# EAGLE design dsky_md_2.1v (EAGLE 6.5.0)
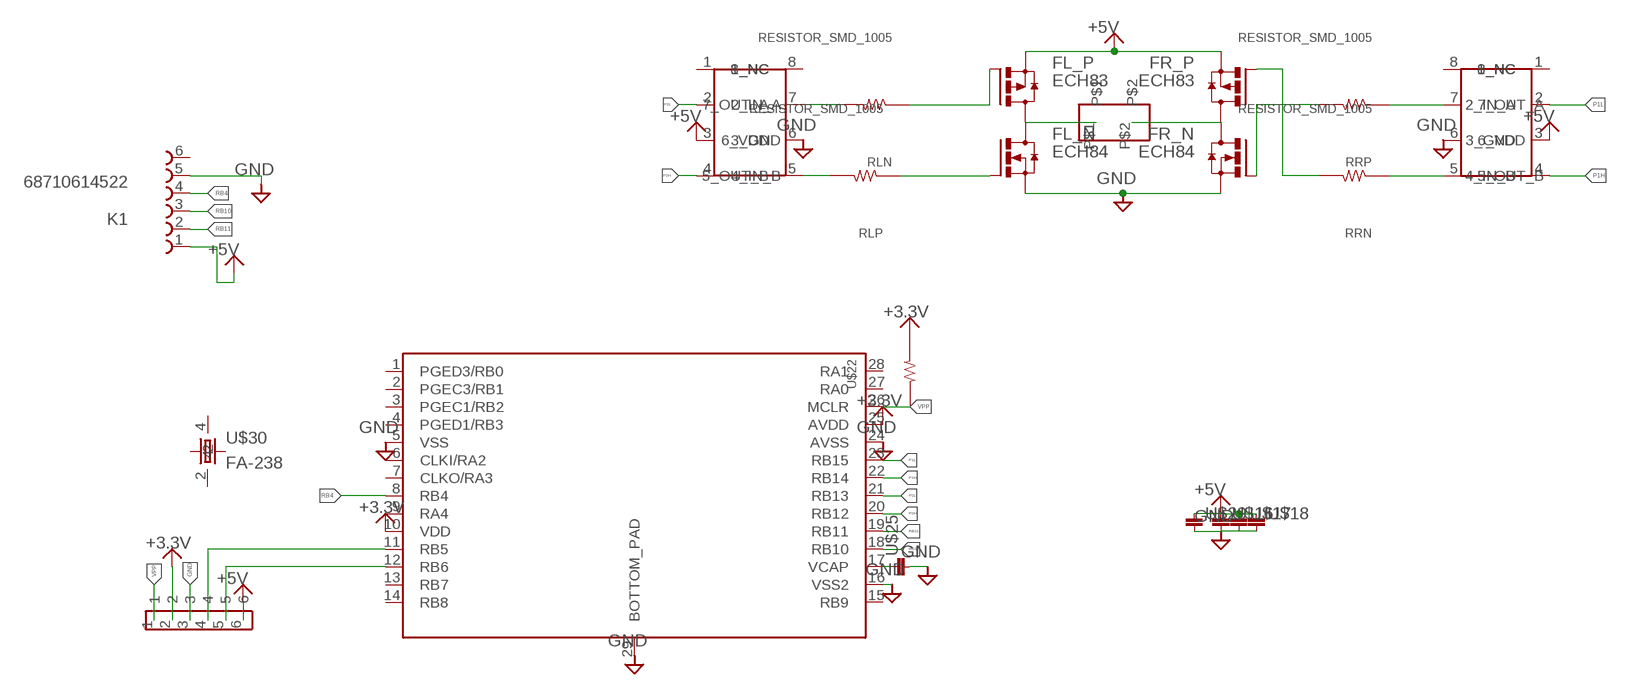
[diagram p0: schematic, sheet 1]

## Parts
FL_N  ECH84  [ECH8]
FL_P  ECH83  [ECH8]
FR_N  ECH84  [ECH8]
FR_P  ECH83  [ECH8]
IC_L  TC1427COA  [SOIC8]
IC_R  TC1427COA  [SOIC8]
K1  68710614522  [68710614522]
RLN  RESISTOR_SMD_1005  [1005]
RLP  RESISTOR_SMD_1005  [1005]
RRN  RESISTOR_SMD_1005  [1005]
RRP  RESISTOR_SMD_1005  [1005]
U$3  PIN_HEADER_2  [PIN_HEADER_2S]
U$5  DSPIC33EP32MC202  [QFN-S28_6X6MC]
U$6  PIN_HEADER_HALF_6  [PIN_HEADER_HALF_6]
U$16  1608  [1608]
U$17  1608  [1608]
U$18  1608  [1608]
U$22  RESISTOR__SMD  [1608]
U$25  1608  [1608]
U$29  2012  [2012]
U$30  FA-238  [FA-238]

## Nets
+3.3V: U$5.10(VDD) U$5.25(AVDD) U$6.2 U$22.2
+5V: FL_P.1(S) FL_P.2(S) FL_P.3(S) FR_P.1(S) FR_P.2(S) FR_P.3(S) IC_L.3(3_GND) IC_R.3(3_GND) K1.1 U$6.6 U$16.P$1 U$17.P$1 U$18.P$1 U$29.1
GND: FL_N.1(S) FL_N.2(S) FL_N.3(S) FR_N.1(S) FR_N.2(S) FR_N.3(S) IC_L.6(6_VDD) IC_R.6(6_VDD) K1.5 U$5.5(VSS) U$5.16(VSS2) U$5.24(AVSS) U$5.29(BOTTOM_PAD) U$6.3 U$16.P$2 U$17.P$2 U$18.P$2 U$25.P$2 U$29.2
M_L: FL_N.5(D) FL_N.6(D) FL_N.7(D) FL_N.8(D) FL_P.5(D) FL_P.6(D) FL_P.7(D) FL_P.8(D) U$3.P$1
M_R: FR_N.5(D) FR_N.6(D) FR_N.7(D) FR_N.8(D) FR_P.5(D) FR_P.6(D) FR_P.7(D) FR_P.8(D) U$3.P$2
N$1: FL_P.4(G) RLN.1
N$2: FL_N.4(G) RLP.1
N$3: IC_L.7(7_OUT_A) RLN.2
N$4: FR_P.4(G) RRN.2
N$5: IC_L.5(5_OUT_B) RLP.2
N$6: IC_R.7(7_OUT_A) RRP.1
N$7: U$5.17(VCAP) U$25.P$1
N$9: IC_R.5(5_OUT_B) RRN.1
N$10: U$5.11(RB5) U$6.4
N$11: U$5.12(RB6) U$6.5
N$12: FR_N.4(G) RRP.2
P1H: IC_R.4(4_IN_B) U$5.22(RB14)
P1L: IC_R.2(2_IN_A) U$5.23(RB15)
P2H: IC_L.4(4_IN_B) U$5.20(RB12)
P2L: IC_L.2(2_IN_A) U$5.21(RB13)
RB4: K1.4 U$5.8(RB4)
RB10: K1.3 U$5.18(RB10)
RB11: K1.2 U$5.19(RB11)
VPP: U$5.26(MCLR) U$6.1 U$22.1
Unconnected: IC_L.1(1_NC) IC_L.8(8_NC) IC_R.1(1_NC) IC_R.8(8_NC) K1.6 U$5.1(PGED3/RB0) U$5.2(PGEC3/RB1) U$5.3(PGEC1/RB2) U$5.4(PGED1/RB3) U$5.6(CLKI/RA2) U$5.7(CLKO/RA3) U$5.9(RA4) U$5.13(RB7) U$5.14(RB8) U$5.15(RB9) U$5.27(RA0) U$5.28(RA1) U$30.1 U$30.2 U$30.3 U$30.4

## Library data of the parts
FL_N FR_N = 06_FET:ECH84
FL_P FR_P = 06_FET:ECH83
IC_L IC_R = 04_IC:TC1427COA
K1 = Wuerth_Elektronik_eiCan_03_ZIF_Connectors_Flat_Flexible_Cable:68710614522: WE-FPC 0.5mm SMT ZIF Horizontal Bottom Contact, 6 Pins
RLN RLP RRN RRP = 01_R:RESISTOR_SMD_1005
U$3 = 08_CONECTOR:PIN_HEADER_2
U$5 = microchip-dspic:DSPIC33EP32MC202
U$6 = 08_CONECTOR:PIN_HEADER_HALF_6
U$16-U$18 U$25 = 02_C:1608
U$22 = 01_R:RESISTOR__SMD
U$29 = 02_C:2012
U$30 = 09_2_CRYSTAL:FA-238

## Board
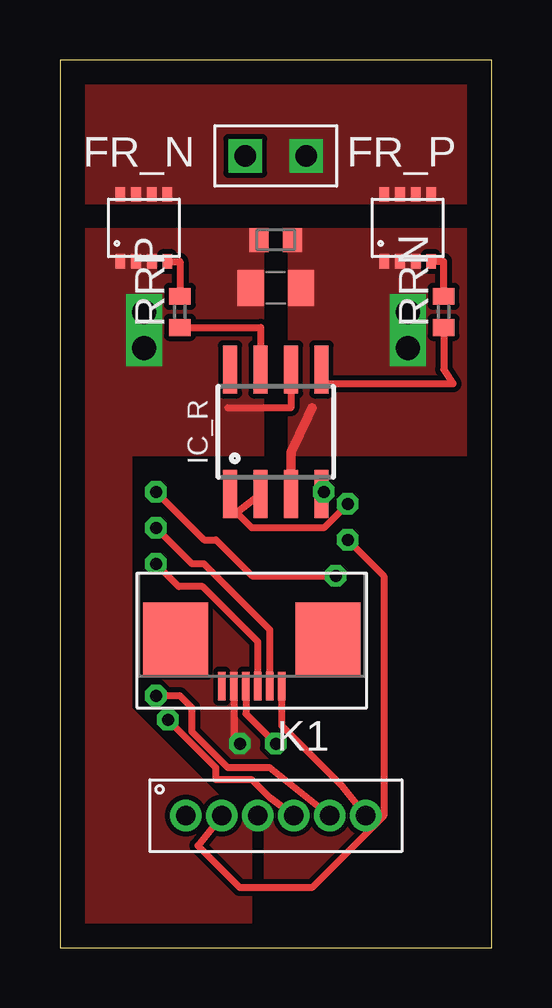
[diagram p1: board, top side]
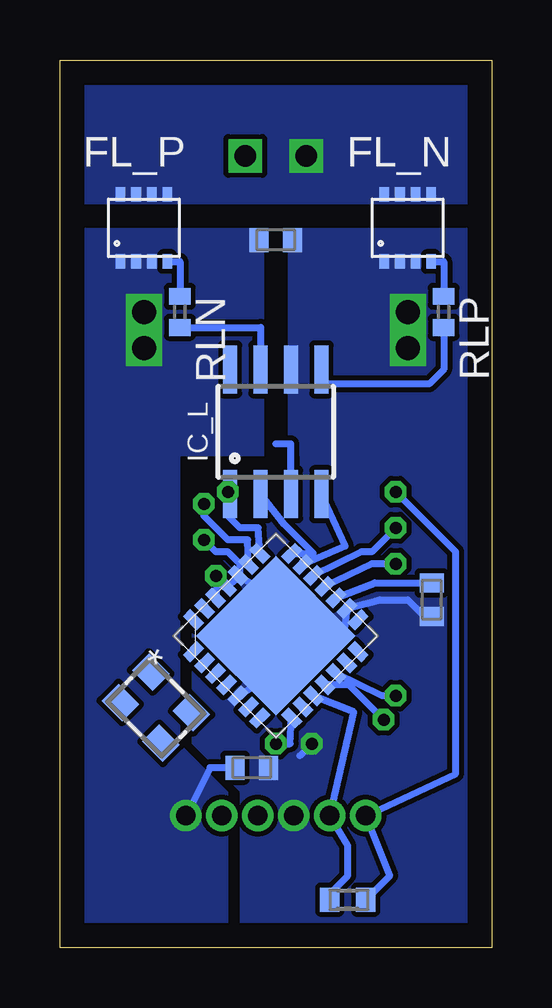
[diagram p2: board, bottom side, seen from below]

Size 18 x 37 mm. Coordinates in mm from the lower left corner, seen from the top.
Outline: 0,0 18,0 18,37 0,37 0,0
Copper layers (1*16): Top 0.035mm / dielectric 1.5mm / Bottom 0.035mm
Design rules "default": minimum track width 10mil, minimum drill 24mil, track to track 8mil, track to pad 8mil, pad to pad 8mil, via to via 8mil, smd to smd 8mil, copper to edge 40mil, drill to drill 8mil, minimum pad ring 10mil, minimum via ring 8mil, stop-mask expansion 4mil, vias tented up to drill 0mil, thermal gap 10mil

### Footprints (pad centres in the part's own frame; a part is rotated, then mirrored left to right if it is on the bottom)
ECH8 = smd 0.4 x 0.6: 1 -0.975,-1.4; 2 -0.325,-1.4; 3 0.325,-1.4; 4 0.975,-1.4; 5 0.975,1.4; 6 0.325,1.4; 7 -0.325,1.4; 8 -0.975,1.4
SOIC8 = smd 0.6 x 2: 1 -1.905,-2.6; 2 -0.635,-2.6; 3 0.635,-2.6; 4 1.905,-2.6; 5 1.905,2.6; 6 0.635,2.6; 7 -0.635,2.6; 8 -1.905,2.6
68710614522 = smd 0.3 x 1.2: 1 -1.25,0.6; 2 -0.75,0.6; 3 -0.25,0.6; 4 0.25,0.6; 5 0.75,0.6; 6 1.25,0.6 | smd 2.7 x 3: Z1 -3.18,-1.38; Z2 3.18,-1.38
1005 = smd 0.7 x 0.9: 1 -0.65,0; 2 0.65,0
PIN_HEADER_2S = drill 0.9 square: P$1 -1.27,0; P$2 1.27,0
QFN-S28_6X6MC = smd 0.813 x 0.432: 1 -2.896,1.956; 2 -2.896,1.295; 3 -2.896,0.66; 4 -2.896,0; 5 -2.896,-0.66; 6 -2.896,-1.295; 7 -2.896,-1.956; 15 2.896,-1.956; 16 2.896,-1.295; 17 2.896,-0.66; 18 2.896,0; 19 2.896,0.66; 20 2.896,1.295; 21 2.896,1.956 | smd 0.432 x 0.813: 8 -1.956,-2.896; 9 -1.295,-2.896; 10 -0.66,-2.896; 11 0,-2.896; 12 0.66,-2.896; 13 1.295,-2.896; 14 1.956,-2.896; 22 1.956,2.896; 23 1.295,2.896; 24 0.66,2.896; 25 0,2.896; 26 -0.66,2.896; 27 -1.295,2.896; 28 -1.956,2.896 | smd 4.699 x 4.699: 29 0,0
PIN_HEADER_HALF_6 = drill 0.8 pad 1.2: 1 -3,0; 2 -1.5,0; 3 0,0; 4 1.5,0; 5 3,0; 6 4.5,0
1608 = smd 0.8 x 1: P$1 -0.7,0; P$2 0.7,0
1608' = smd 0.8 x 1: 1 -0.75,0; 2 0.75,0
2012 = smd 1.1 x 1.5: 1 -1.05,0; 2 1.05,0
FA-238 = smd 1.2 x 1: 1 -1.2,-0.9; 2 1.2,-0.9; 3 1.2,0.9; 4 -1.2,0.9

### Placement (x,y rotation side)
FL_N  3.5,30 0 bottom
FL_P  14.5,30 0 bottom
FR_N  3.5,30 0 top
FR_P  14.5,30 0 top
IC_L  9,21.5 0 bottom
IC_R  9,21.5 0 top
K1  8,11.5 180 top
RLN  13,26.5 270 bottom
RLP  2,26.5 270 bottom
RRN  16,26.5 90 top
RRP  5,26.5 90 top
U$3  9,33 0 top
U$5  9,13 45 bottom
U$6  8.25,5.5 0 top
U$16  9,29.5 180 top
U$17  9,29.5 0 bottom
U$18  10,7.5 0 bottom
U$22  [1608']  6,2 180 bottom
U$25  2.5,14.5 270 bottom
U$29  9,27.5 180 top
U$30  14,10 315 bottom

### Tracks (layer width: path | path; a pad name or v marks a point on that pad's centre or on a via)
+3.3V  (via drill 0.5)
  Top 0.3: v12,17 13.5,15.5 13.5,5.5 10.5,2.5 7.5,2.5 5.75,4.25 U$6.2
  Bottom 0.3: U$22.2 6.75,2.25 6,3 6,4.25 U$6.2 5.75,9.82 U$5.10 | U$5.25 10.5,15.5 10.5,16 11,16.5 11.5,16.5 v12,17
+5V  (via drill 1)
  Top 0.3: U$6.6 11.75,6.75 9.25,9.25 K1.1
  Top 0.4: IC_R.3 9.63,20.64 10.5,22.5
  Bottom 0.3: IC_L.3 8.37,21 9,21 | U$18.P$1 11.75,7.5 U$6.6
  other vias: 14.5,26.5 14.5,25
  pour Top (no thermals): 9.5,30 17,30 17,20.5 9.5,20.5
  pour Bottom (no thermals): 9.5,30 17,30 17,20.5 9.5,20.5
  pour Bottom (no thermals): 17,27 17,1 11,1 11,6.5 13,8.5 13,27
GND  (via drill 0.5, 1)
  Top 0.3: IC_R.6 9.63,22.5 7,22.5 | K1.5 7.25,8.75 v7.5,8.5
  Bottom 0.3: U$5.5 8,12.07 U$5.29 | U$5.24 8,13.93 U$5.29 | U$5.29 6.17,13 U$5.16 4.67,14.5 3.5,14.5 2.8,13.8 U$25.P$2 | v7.5,8.5 8,8
  other vias: 3.5,26.5 3.5,25
  pour Top (no thermals): 1,30 8.5,30 8.5,20.5 1,20.5
  pour Bottom (no thermals): 1,30 8.5,30 8.5,20.5 1,20.5
  pour Top (no thermals): 1,26 1,1 8,1 8,5 3,10 3,26
  pour Bottom (no thermals): 1,22.5 8,22.5 8,19 12.5,19 12.5,8.5 10.5,6.5 10.5,1 1,1
  pour Top (no thermals): 17,1 8.5,1 8.5,7.5 3.5,7.5 3.5,21.5 17,21.5
M_L
  pour Bottom (no thermals): 1,36 17,36 17,31 1,31
M_R
  pour Top (no thermals): 1,36 17,36 17,31 1,31
N$1
  Bottom 0.3: FL_P.4 13,28.6 RLN.1
N$2
  Bottom 0.3: FL_N.4 2,28.6 RLP.1
N$3
  Bottom 0.3: RLN.2 9.63,25.85 IC_L.7
N$4
  Top 0.3: RRN.2 16,28.6 FR_P.4
N$5
  Bottom 0.3: RLP.2 2,24.1 2.6,23.5 7,23.5 7.09,23.59 IC_L.5
N$6
  Top 0.3: RRP.1 8.37,25.85 IC_R.7
N$7
  Bottom 0.3: U$5.17 4.87,15.2 U$25.P$1
N$9
  Top 0.3: RRN.1 16,24.1 16.4,23.5 11,23.5 10.9,23.59 IC_R.5
N$10  (via drill 0.5)
  Top 0.3: U$6.4 8.75,6.25 8,7 6.5,7 6.5,7.5 v4.5,9.5
  Bottom 0.3: v4.5,9.5 5.95,10.95 U$5.11
N$11  (via drill 0.5)
  Top 0.3: U$6.5 8.75,7.5 7,7.5 5.5,9 5.5,10 5,10.5 v4,10.5
  Bottom 0.3: v4,10.5 4.57,10.5 U$5.12
N$12
  Top 0.3: FR_N.4 5,28.6 RRP.2
P1H  (via drill 0.5)
  Top 0.3: v11,19 IC_R.4
  Bottom 0.3: U$5.22 9.73,17.5 10.5,17.5 11,18 v11,19
P1L  (via drill 0.5)
  Top 0.3: v12,18.5 11,17.5 8,17.5 7.37,18.14 IC_R.2
  Bottom 0.3: U$5.23 10.17,17 11,17 12,18 v12,18.5
P2H
  Bottom 0.3: U$5.20 6.09,16.74 IC_L.4
P2L
  Bottom 0.3: U$5.21 7.43,16.43 8.63,17.64 IC_L.2
RB4  (via drill 0.5)
  Top 0.3: K1.4 7.75,9.75 v9,8.5
  Bottom 0.3: v9,8.5 8.41,8.5 U$5.8
RB10  (via drill 0.5)
  Top 0.3: K1.3 8.25,12.75 5.95,15.05 4.95,15.05 v4,16
  Bottom 0.3: v4,16 5,16 U$5.18
RB11  (via drill 0.5)
  Top 0.3: K1.2 8.75,13.25 6,16 5.5,16 v4,17.5
  Bottom 0.3: v4,17.5 5,16.5 5.43,16.5 U$5.19
VPP  (via drill 0.5)
  Top 0.3: v4,19 6,17 6.5,17 8,15.5 v11.5,15.5
  Bottom 0.3: U$22.1 4.25,3 U$6.1 1.5,7.25 1.5,16.5 v4,19 | v11.5,15.5 11.43,15.5 U$5.26